# EasyEDA schematic lolin32-alarmclock.json
TITLE: Sheet_1; REV: 1.0; Date: 2020-04-18; Sheet: 1/1; Company: Your Company
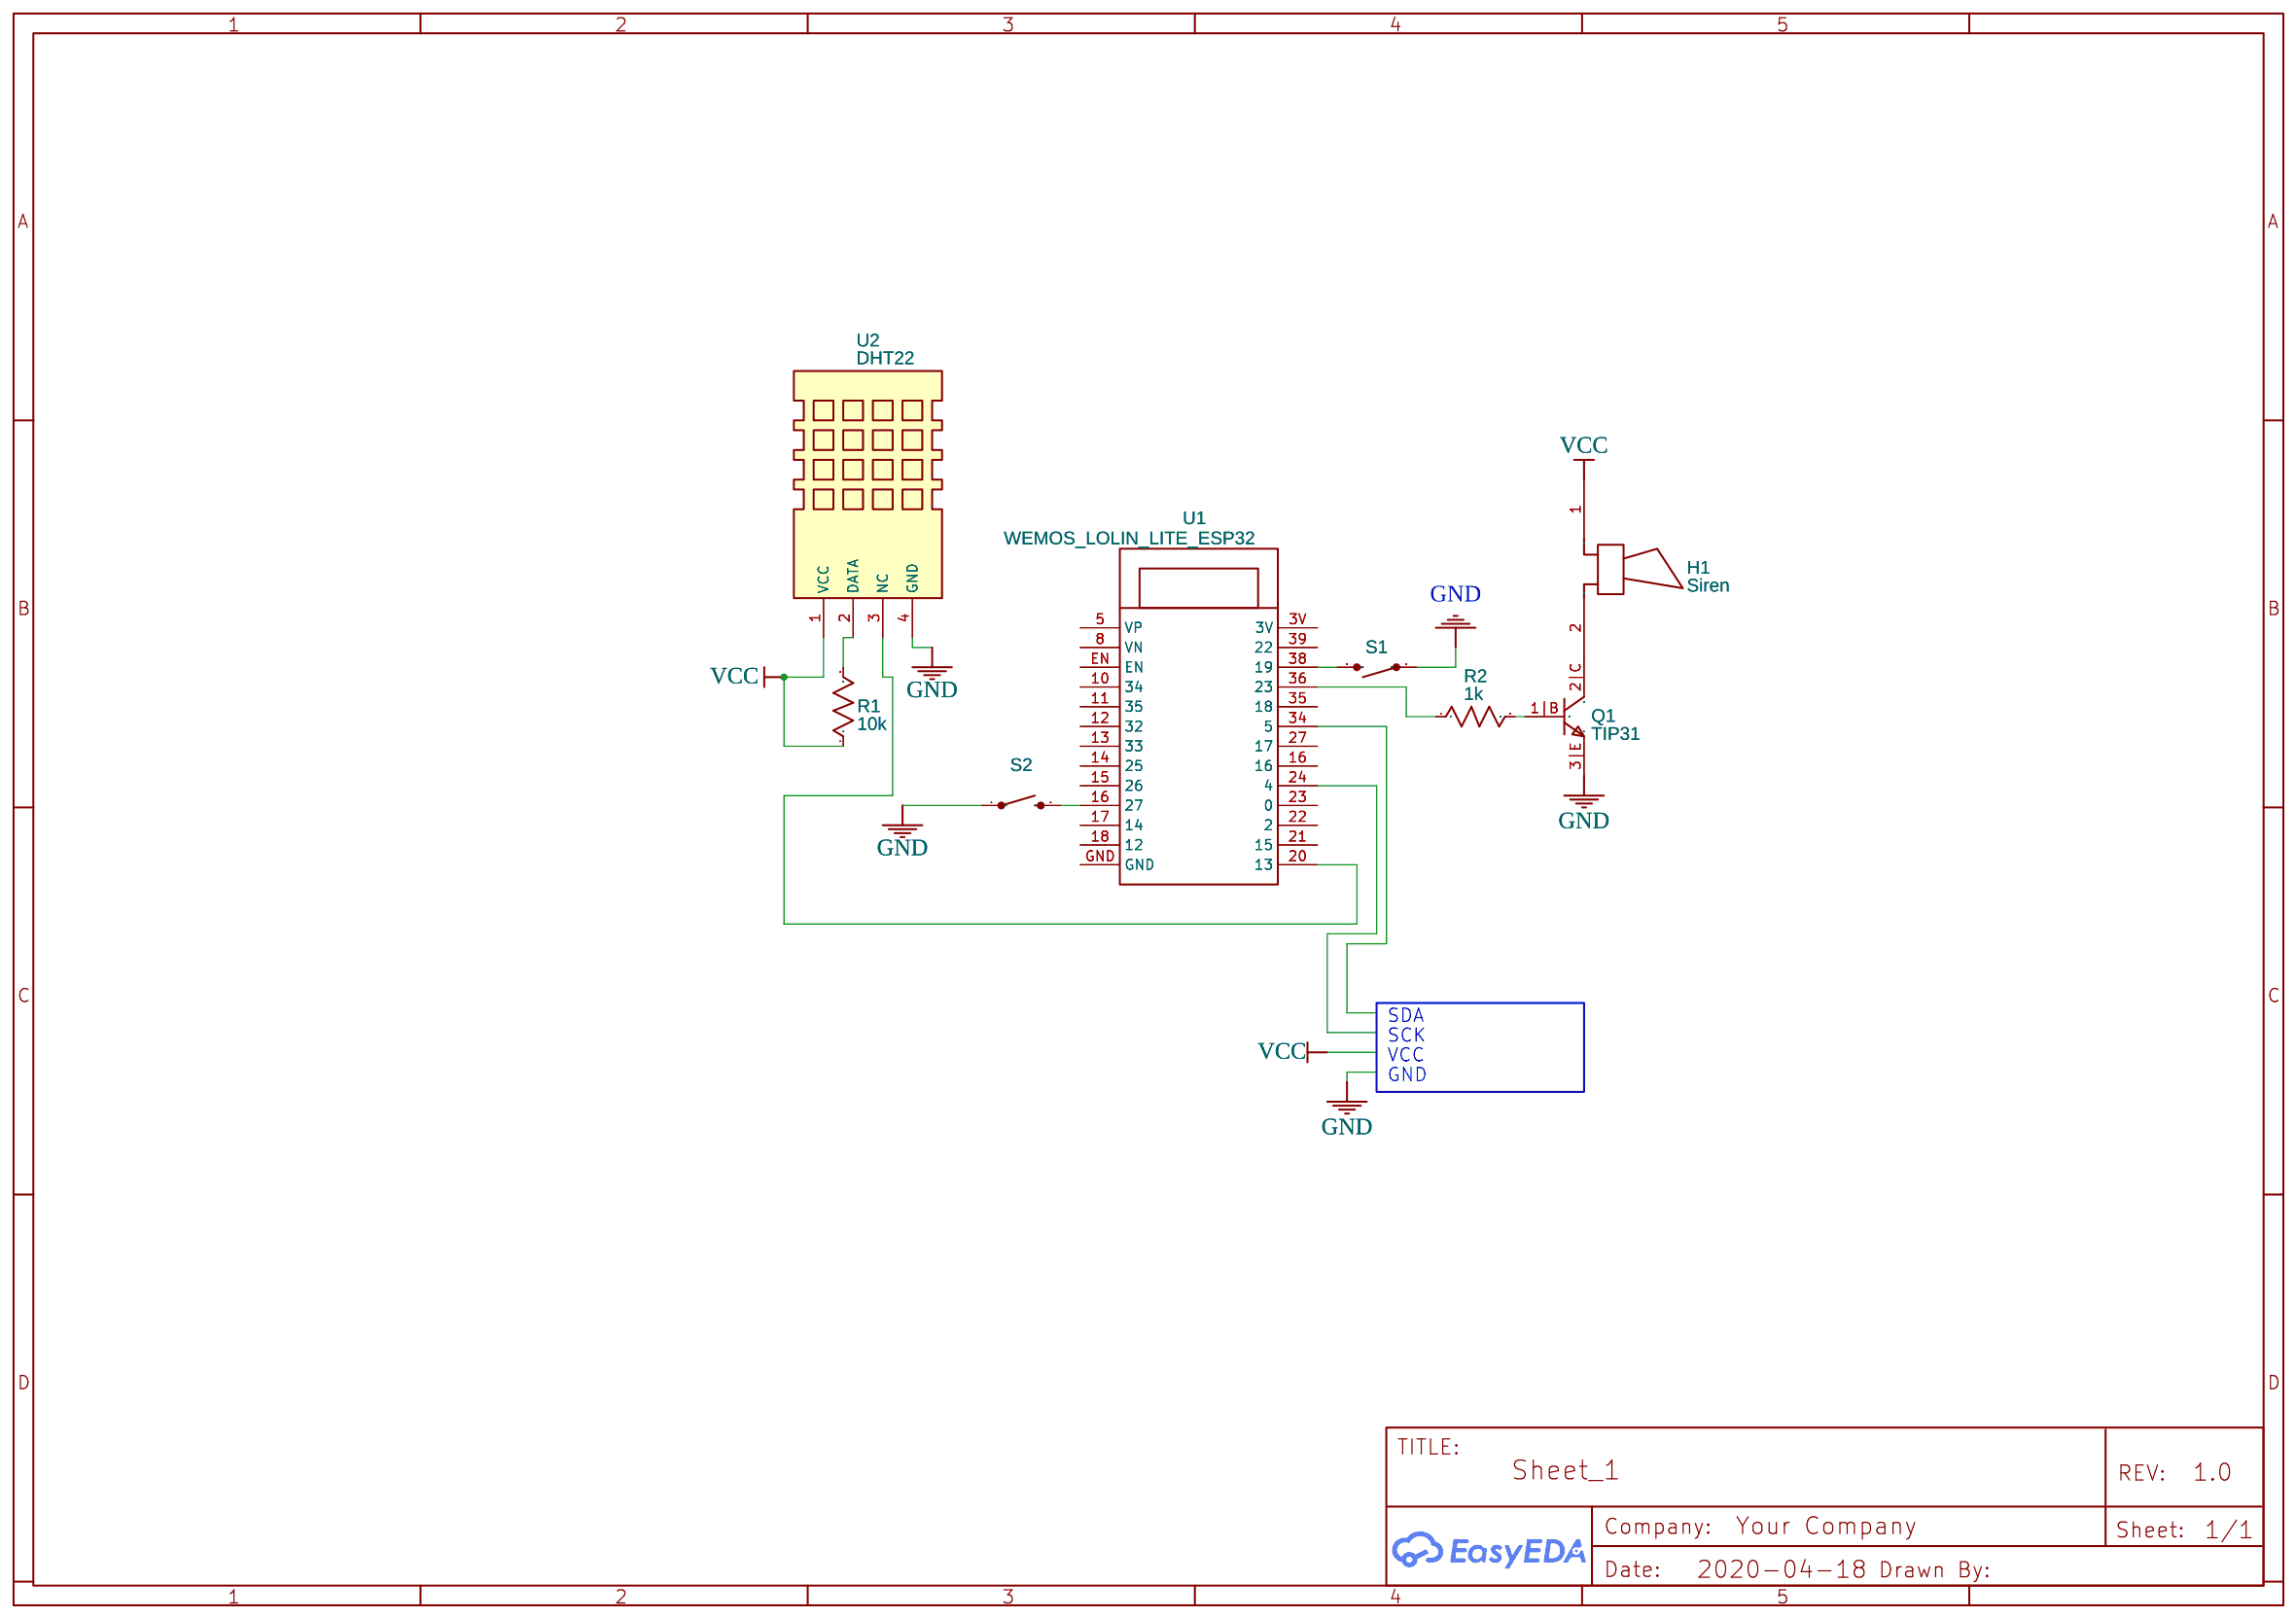
[diagram p0: schematic sheet]

## Parts
#1  -
H1  Siren
Q1  TIP31  [TO-220]
R1  10k  [AXIAL-0.3]
R2  1k  [AXIAL-0.3]
S1  SWITCH-MOMENTARY-2  [TACTILE-PTH-12MM]
S2  SWITCH-MOMENTARY-2  [TACTILE-PTH-12MM]
U1  WEMOS_LOLIN_LITE_ESP32  [WEMOS_LOLIN32_LITE]
U2  DHT22  [DHT22_AM2303_VERT]

## Library data of the parts
#1 = -: BOM_Manufacturer Part: ?
H1 = Siren: Contributor: HATTRICK
Q1 = TIP31: Complementary Silicon Plastic Power Transistor, 3-Pin TO-220, Tube
R1 R2 = Res_AXIAL-0.3(1/8W)_US
S1 S2 = SWITCH-MOMENTARY-2: Contributor: SparkFun
U1 = WEMOS_LOLIN_LITE_ESP32: catid: 20; Contributor: sectionfu; Supplier: WEMOS; sim: true
U2 = DHT22: Digital-output relative humidity & temperature sensor/module; sourceId: GkiDrp9vf; Supplier Part: PRODUCT ID: 385; Supplier: AdaFruit; Voltage: 3.3V - 5.5V; Mounted: Yes; Manufacturer: Aosong (Guangzhou) Electronics Co., Ltd.; link: https://cdn-shop.adafruit.com/datasheets/DHT22.pdf

## Nets
GND: Q1.3|E(E) S1.1 S2.1 U2.4(GND)
VCC: H1.1 R1.1 U2.1(VCC)
Net-(H1-2): H1.2 Q1.2|C(C)
Net-(Q1-1|B): Q1.1|B(B) R2.2
Net-(R1-2): R1.2 U2.2(DATA)
Net-(R2-1): R2.1 U1.36(23)
Net-(S1-3): S1.3(2) U1.38(19)
Net-(S2-3): S2.3(2) U1.16(27)
Net-(U1-20): U1.20(13) U2.3(NC)

Not connected (* = marked no-connect by the designer): U1 3V 5(VP) 8(VN) 10(34) 11(35) 12(32) 13(33) 14(25) 15(26) 17(14) 18(12) 21(15) 22(2) 23(0) 24(4) 27(17) 34(5) 35(18) 39(22) EN GND

## Notes on the sheet
- SCK
- SDA
- VCC
- GND
